# EAGLE design LP11F7826 (EAGLE 6.2)
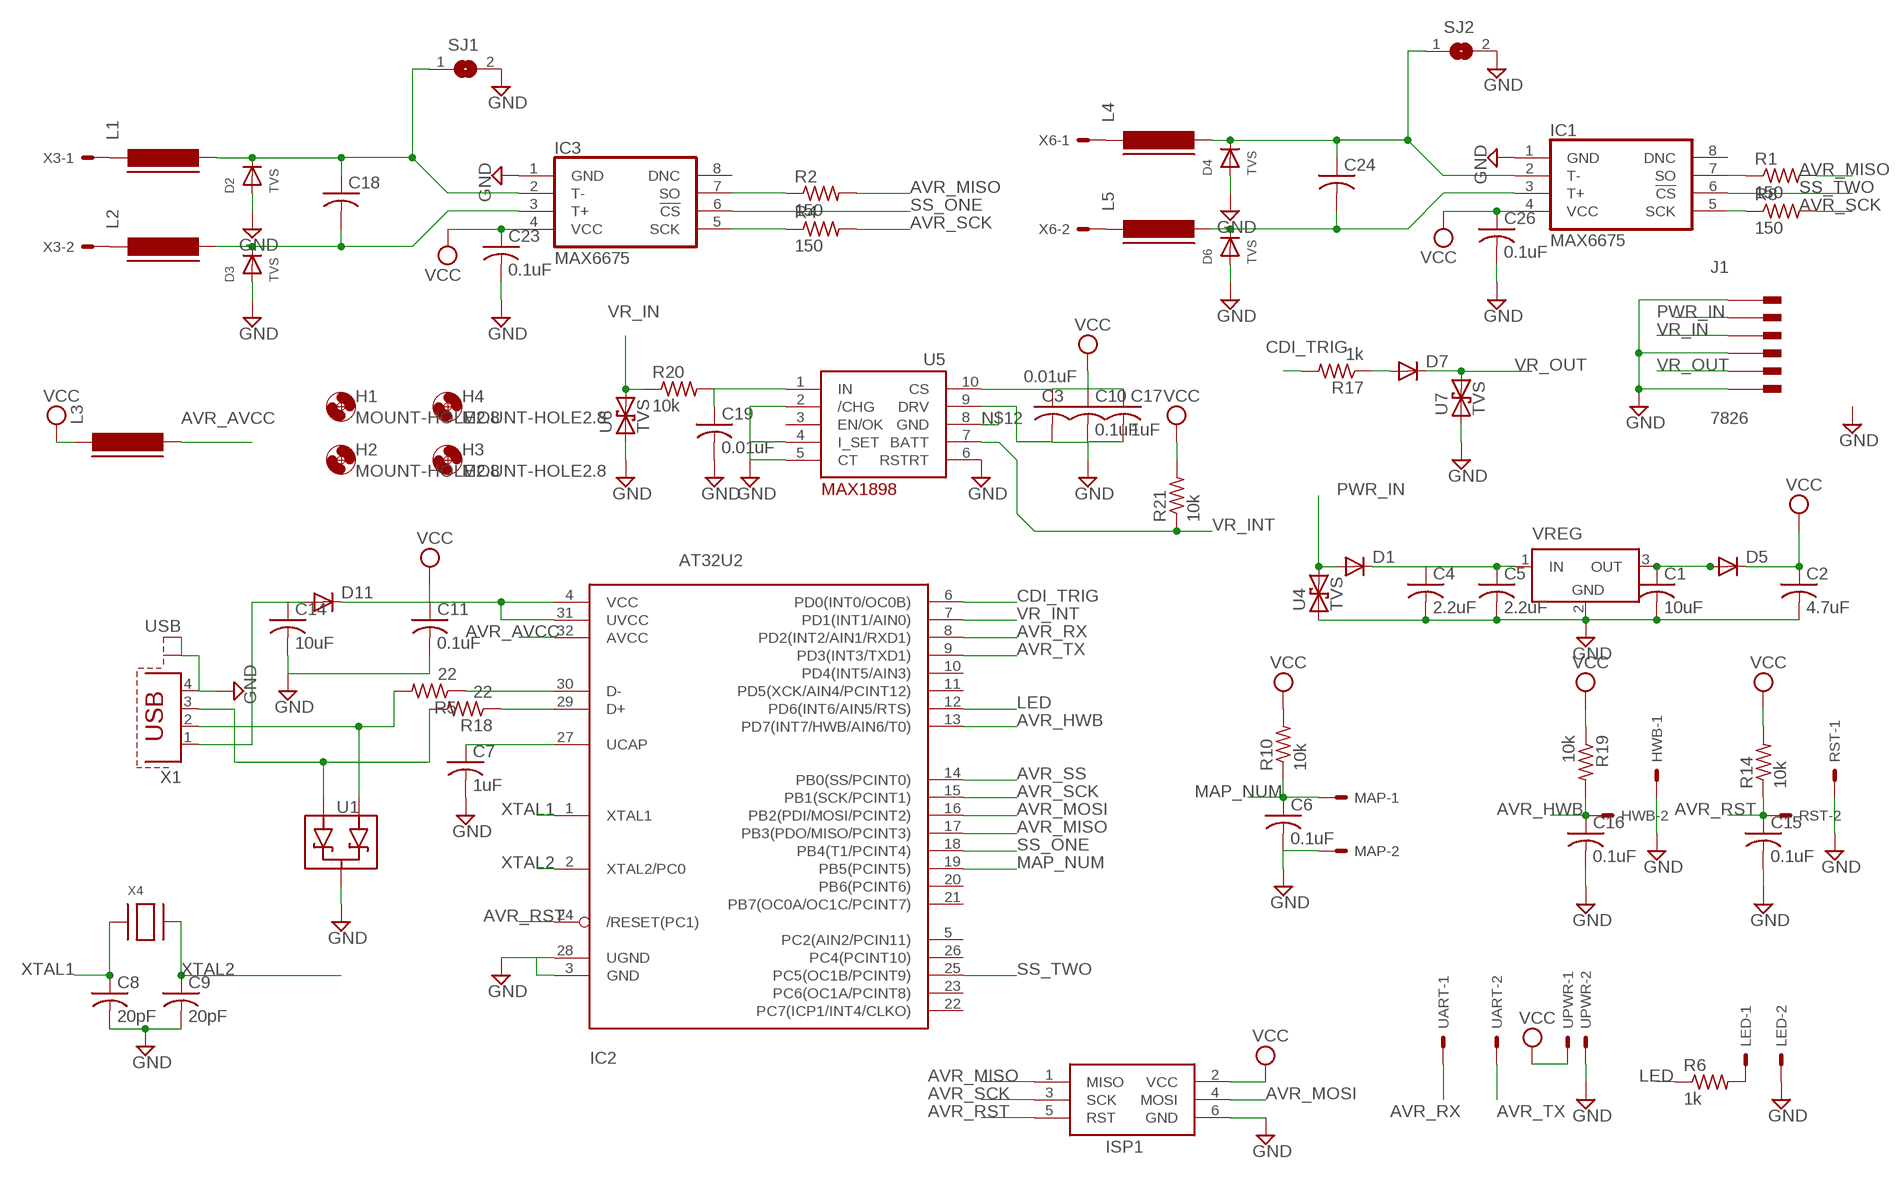
[diagram p0: schematic, sheet 1]

## Parts
C1  10uF  C-USC1206  [C1206]
C2  4.7uF  C-USC1210  [C1210]
C3  0.01uF  C-USC0805  [C0805]
C4  2.2uF  C-USC1206  [C1206]
C5  2.2uF  C-USC1210  [C1210]
C6  0.1uF  C-USC0805  [C0805]
C7  1uF  C-USC0805  [C0805]
C8  20pF  C-USC0805  [C0805]
C9  20pF  C-USC0805  [C0805]
C10  0.1uF  C-USC0805  [C0805]
C11  0.1uF  C-USC0805  [C0805]
C14  10uF  C-USC0805  [C0805]
C15  0.1uF  C-USC0805  [C0805]
C16  0.1uF  C-USC0805  [C0805]
C17  1uF  C-USC0805  [C0805]
C18  C-USC0805  [C0805]
C19  0.01uF  C-USC0805  [C0805]
C23  0.1uF  C-USC0805  [C0805]
C24  C-USC0805  [C0805]
C26  0.1uF  C-USC0805  [C0805]
D1  CGRM4001-G  [SOD-123_MINI-SMA]
D2  TVS  DIODESOD-323F  [SOD-323F]
D3  TVS  DIODESOD-323F  [SOD-323F]
D4  TVS  DIODESOD-323F  [SOD-323F]
D5  CGRM4001-G  [SOD-123_MINI-SMA]
D6  TVS  DIODESOD-323F  [SOD-323F]
D7  CGRM4001-G  [SOD-123_MINI-SMA]
D11  CGRM4001-G  [SOD-123_MINI-SMA]
H1  MOUNT-HOLE2.8  [2,8]
H2  MOUNT-HOLE2.8  [2,8]
H3  MOUNT-HOLE2.8  [2,8]
H4  MOUNT-HOLE2.8  [2,8]
HWB  87758-0216  [87758-0216]
IC1  MAX6675  IC_MAX31855-SO-8  [SO-8]
IC2  AT32U2  ATMEGA32U2-TQFP  [TQFP32-08]
IC3  MAX6675  IC_MAX31855-SO-8  [SO-8]
ISP1  AVRISP-6  [AVRISP]
J1  7826  PIN262409-1  [7806HEADER]
L1  FERRITE-0805  [FB805]
L2  FERRITE-0805  [FB805]
L3  FERRITE-0805  [FB805]
L4  FERRITE-0805  [FB805]
L5  FERRITE-0805  [FB805]
LED  87758-0216  [87758-0216]
MAP  87758-0216  [87758-0216]
R1  150  R-US_R0805  [R0805]
R2  150  R-US_R0805  [R0805]
R4  150  R-US_R0805  [R0805]
R5  22  R-US_R0805  [R0805]
R6  1k  R-US_R0805  [R0805]
R8  150  R-US_R0805  [R0805]
R10  10k  R-US_R0805  [R0805]
R14  10k  R-US_R0805  [R0805]
R17  1k  R-US_R0805  [R0805]
R18  22  R-US_R0805  [R0805]
R19  10k  R-US_R0805  [R0805]
R20  10k  R-US_R0805  [R0805]
R21  10k  R-US_R0805  [R0805]
RST  87758-0216  [87758-0216]
SJ1  SJ  [SJ]
SJ2  SJ  [SJ]
U1  MMBZ27VCLT1  [SOT23-3]
U4  TVS  [SMA-DIODE]
U5  MAX9924  MAX1898U  [UMAX10]
U6  TVS  [SMA-DIODE]
U7  TVS  [SMA-DIODE]
UART  87758-0216  [87758-0216]
UPWR  87758-0216  [87758-0216]
VREG  LT1963EST-3.3  [SOT223]
X1  USB  PN61729-S  [PN61729-S]
X3  22-23-2021  [22-23-2021]
X4  XTALNX5032  [NX5032]
X6  22-23-2021  [22-23-2021]

## Nets
AVR_AVCC: IC2.32(AVCC) L3.2
AVR_HWB: C16.1 HWB.2 IC2.13(PD7(INT7/HWB/AIN6/T0)) R19.2
AVR_MISO: IC2.17(PB3(PDO/MISO/PCINT3)) ISP1.1(MISO) R1.2 R2.2
AVR_MOSI: IC2.16(PB2(PDI/MOSI/PCINT2)) ISP1.4(MOSI)
AVR_RST: C15.1 IC2.24(/RESET(PC1)) ISP1.5(RST) R14.1 RST.2
AVR_RX: IC2.8(PD2(INT2/AIN1/RXD1)) UART.1
AVR_SCK: IC2.15(PB1(SCK/PCINT1)) ISP1.3(SCK) R4.2 R8.2
AVR_SS: IC2.14(PB0(SS/PCINT0))
AVR_TX: IC2.9(PD3(INT3/TXD1)) UART.2
CDI_TRIG: IC2.6(PD0(INT0/OC0B)) R17.2
GND: C1.2 C2.2 C3.2 C4.2 C5.2 C6.2 C7.2 C8.2 C9.2 C10.2 C11.2 C14.2 C15.2 C16.2 C17.2 C19.2 C23.2 C26.2 D2.A D3.A D4.A D6.A HWB.1 IC1.1(GND) IC2.3(GND) IC2.28(UGND) IC3.1(GND) ISP1.6(GND) J1.A1 J1.A2 J1.A5 J1.A6 J1.A11 J1.A12 LED.2 MAP.2 RST.1 SJ1.2 SJ2.2 U1.3(C) U4.A U5.2(/CHG) U5.4(I_SET) U5.5(CT) U5.6(RSTRT) U5.9(DRV) U6.A U7.A UPWR.2 VREG.2(GND) X1.4 X1.S1 X1.S2
LED: IC2.12(PD6(INT6/AIN5/RTS)) R6.1
MAP_NUM: C6.1 IC2.19(PB5(PCINT5)) MAP.1 R10.1
N$1: C14.1 D11.A X1.1
N$5: C4.1 C5.1 D1.C VREG.1(IN)
N$6: C18.1 D2.C IC3.2(T-) L1.2 SJ1.1
N$7: C18.2 D3.C IC3.3(T+) L2.2
N$8: C1.1 D5.A VREG.3(OUT)
N$9: LED.1 R6.2
N$10: C24.1 D4.C IC1.2(T-) L4.2 SJ2.1
N$11: C24.2 D6.C IC1.3(T+) L5.2
N$12: U5.8(GND)
N$13: IC1.5(SCK) R8.1
N$15: IC2.30(D-) R5.1
N$16: L1.1 X3.1
N$17: L2.1 X3.2
N$18: IC3.5(SCK) R4.1
N$19: IC2.29(D+) R18.1
N$20: C7.1 IC2.27(UCAP)
N$22: IC3.7(SO) R2.1
N$23: IC1.7(SO) R1.1
N$24: L4.1 X6.1
N$25: L5.1 X6.2
N$29: R5.2 U1.1(A1) X1.2
N$31: R18.2 U1.2(A2) X1.3
N$35: D7.A R17.1
N$46: C19.1 R20.2 U5.1(IN)
PWR_IN: D1.A J1.A9 J1.A10 U4.C
SS_ONE: IC2.18(PB4(T1/PCINT4)) IC3.6(!CS)
SS_TWO: IC1.6(!CS) IC2.25(PC5(OC1B/PCINT9))
VCC: C2.1 C3.1 C10.1 C11.1 C17.1 C23.1 C26.1 D5.C D11.C IC1.4(VCC) IC2.4(VCC) IC2.31(UVCC) IC3.4(VCC) ISP1.2(VCC) L3.1 R10.2 R14.2 R19.1 R21.2 U5.10(CS) UPWR.1
VR_IN: J1.A7 J1.A8 R20.1 U6.C
VR_INT: IC2.7(PD1(INT1/AIN0)) R21.1 U5.7(BATT)
VR_OUT: D7.C J1.A3 J1.A4 U7.C
XTAL1: C8.1 IC2.1(XTAL1) X4.P$1
XTAL2: C9.1 IC2.2(XTAL2/PC0) X4.P$2
Unconnected: IC1.8(DNC) IC2.5(PC2(AIN2/PCIN11)) IC2.10(PD4(INT5/AIN3)) IC2.11(PD5(XCK/AIN4/PCINT12)) IC2.20(PB6(PCINT6)) IC2.21(PB7(OC0A/OC1C/PCINT7)) IC2.22(PC7(ICP1/INT4/CLKO)) IC2.23(PC6(OC1A/PCINT8)) IC2.26(PC4(PCINT10)) IC3.8(DNC) U5.3(EN/OK)

## Power pins joined to a net without a drawn wire
GND: VREG.4(GND)

## Library data of the parts
C1-C11 C14-C19 C23 C24 C26 = adafruit:C-US: CAPACITOR, American symbol
D1 D5 D7 D11 = diode:CGRM400*-G: Molded plasitc,JEDEC SOD-123/Mini SMA Source: Comchip CGRM4001-G.pdf
D2-D4 D6 = adafruit:DIODE: Diode SMADIODE - SMA Surface Mount Package 20V 1A Schottky Diode Digikey: 641-1014-6-ND DO-1N4148 - Through Hole Small Current Diode SOD-123 20V 1 A (.5mV Vf) Schottky Diode - Digikey: MBRX120TPMSCT-ND SOD-323 10V 570mA (.38mV Vf, 3ns) Schottky Diode - Digikey: ZLLS410CT-ND SOD-523 30V 30mA Schottky Diode (RB751S-40TE61) - Digikey: RB751S-40TE61CT-ND SOT23-R/W - SOT23 Package (R = Solder Paste/Reflow Ovens, W = Hand-Soldering) BAT54Film 40V 300mA - Digikey: 497-7162-1-ND
H1-H4 = holes:MOUNT-HOLE: MOUNTING HOLE with drill center marker
HWB LED MAP RST UART UPWR = con-molex:87758-0216: 2 Pin - 2mm Dual Row Single Wafer, Vertical T/H HDR Source: http://www.molex.com/pdm_docs/sd/877580616_sd.pdf; MPN: 87758-0216; OC_FARNELL: unknown; OC_NEWARK: 94M1513
IC1 IC3 = dp_devices:IC_MAX31855
IC2 = adafruit:ATMEGA32U2: ATmega32u2 Pin compatible with the atmega8u2, atmega16u2 and atmega32u2 8, 16 or 32 K flash, 1K RAM, 512b EEPROM 8 bit and 16 bit timer (5 PWM total) UART, SPI (no I2C!) USB with 4 endpoints, LUFA compatible 22 I/O lines, analog comparator (no ADC!) Comes with DFU bootloader burned in!
ISP1 = adafruit:AVRISP: AVR ISP HEADER Standard 6 pin header for AVR programming
J1 = 7806_quick:PIN2: Flachstecker Typ Tyco/Electronics/AMP TAB, FASTON Printed Circuit Board Tabs Source: http://www.buerklin.com, http://catalog.tycoelectronics.com; OC_FARNELL: unknown; OC_NEWARK: unknown
L1-L5 = dp_devices:FERRITE: Ferrite bead in various packages
R1 R2 R4-R6 R8 R10 R14 R17-R21 = resistor:R-US_: RESISTOR, American symbol
SJ1 SJ2 = jumper:SJ: SMD solder JUMPER
U1 = SparkFun-DiscreteSemi:MMBZ27VCLT1: 40W Zener-diode transient voltage suppressor (ESD protection)
U4 U6 U7 = SparkFun-DiscreteSemi:TVS: Transient voltage suppressor- prevents ESD on inputs. Ignore package description- MBRA140 is NOT this type of part!!!
U5 = adafruit:MAX1898: Maxim MAX1898 li-poly battery charger http://www.ladyada.net/library/eagle
VREG = linear-technology:LT1963EST: 1.5A, Low Noise, Fast Transient Response LDO Regulator Source: http://www.linear.com/pc/downloadDocument.do?navId=H0,C3,P2222,D3148; MPN: LT1963EST-3.3; OC_FARNELL: 1501032; OC_NEWARK: 57M7546
X1 = con-berg:PN61729-S: BERG USB connector; OC_FARNELL: unknown; OC_NEWARK: unknown
X3 X6 = con-molex:22-23-2021: .100" (2.54mm) Center Header - 2 Pin; MF: MOLEX; MPN: 22-23-2021; OC_FARNELL: 1462926; OC_NEWARK: 25C3832
X4 = adafruit:XTAL: Low cost SMT crystals, no capacitors included http://www.ladyada.net/library/eagle

## Board
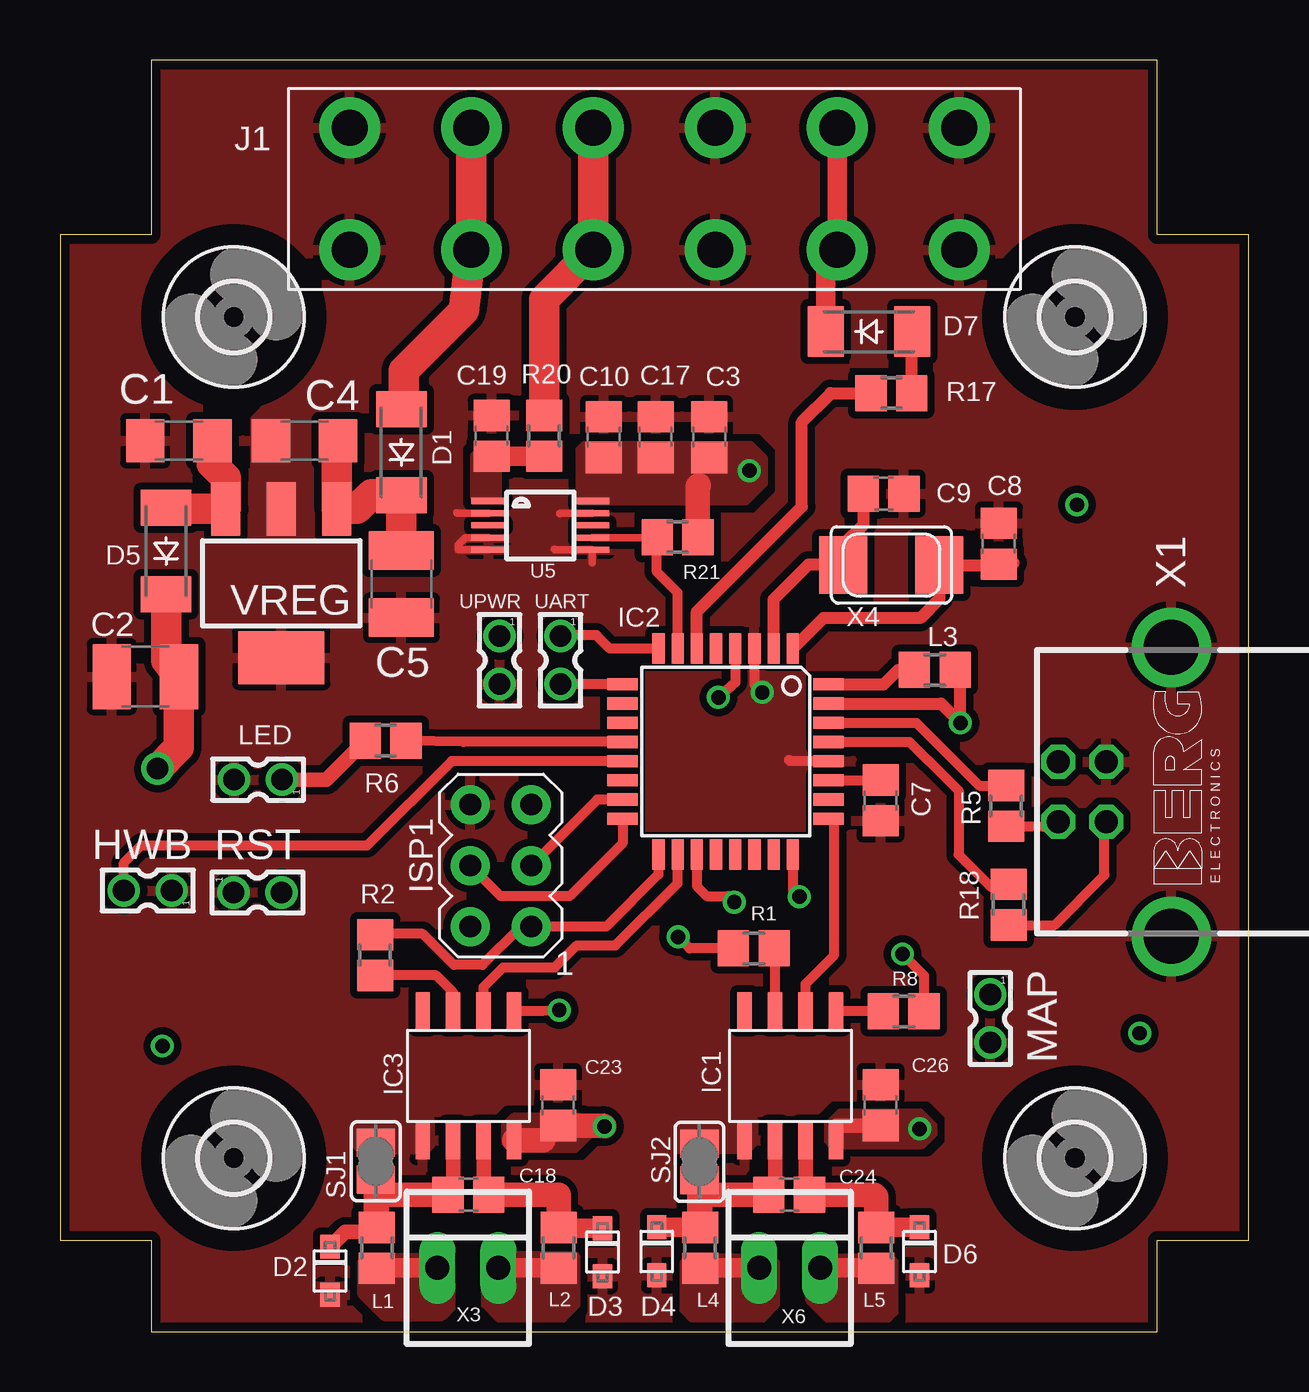
[diagram p1: board, top side]
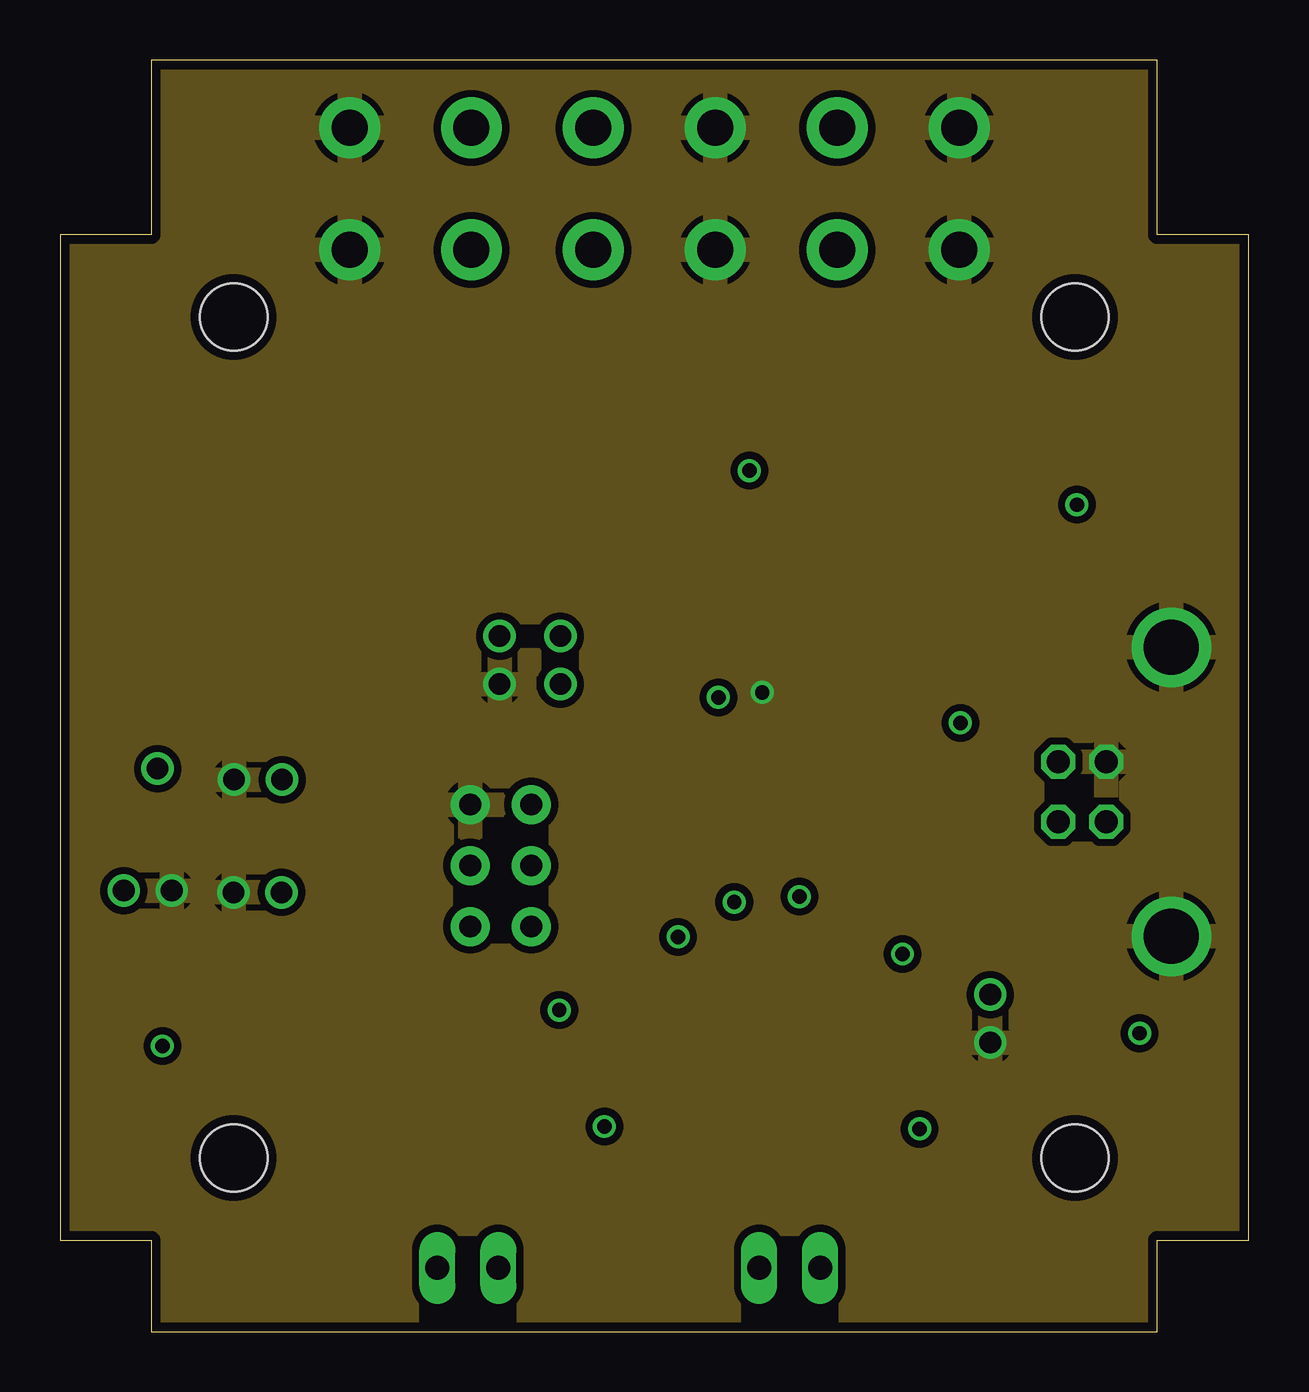
[diagram p2: board, inner layer Route2]
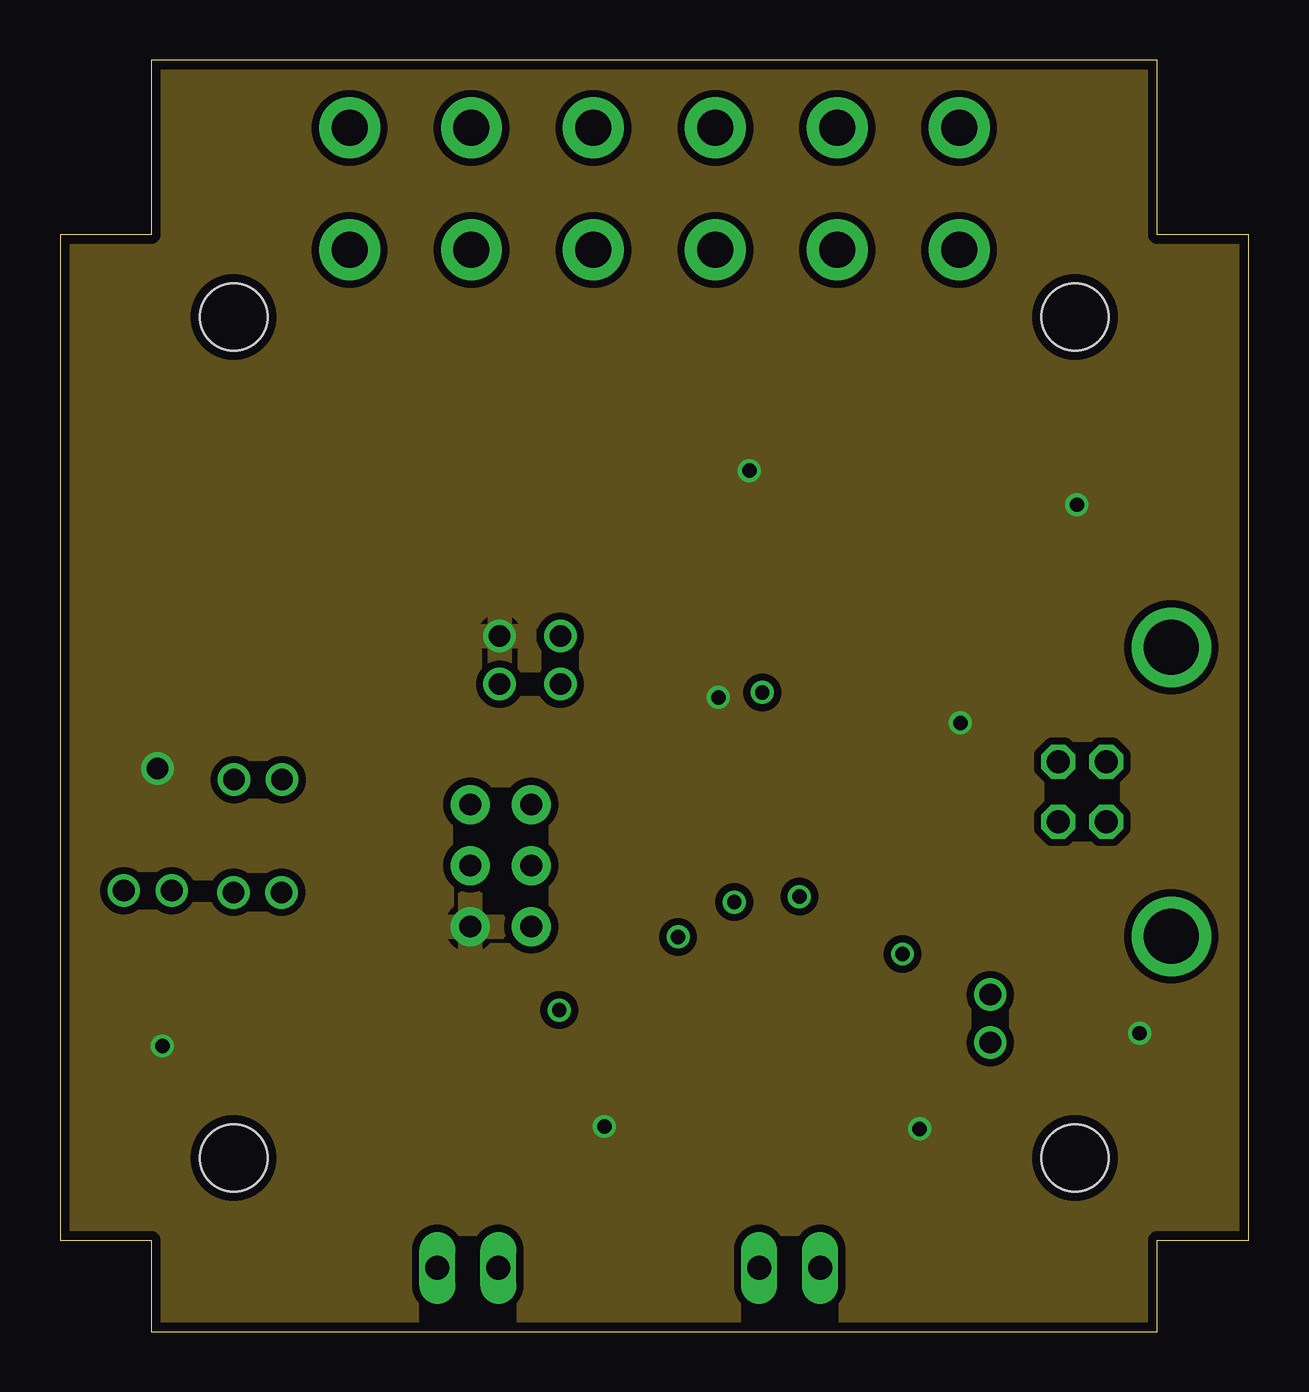
[diagram p3: board, inner layer Route15]
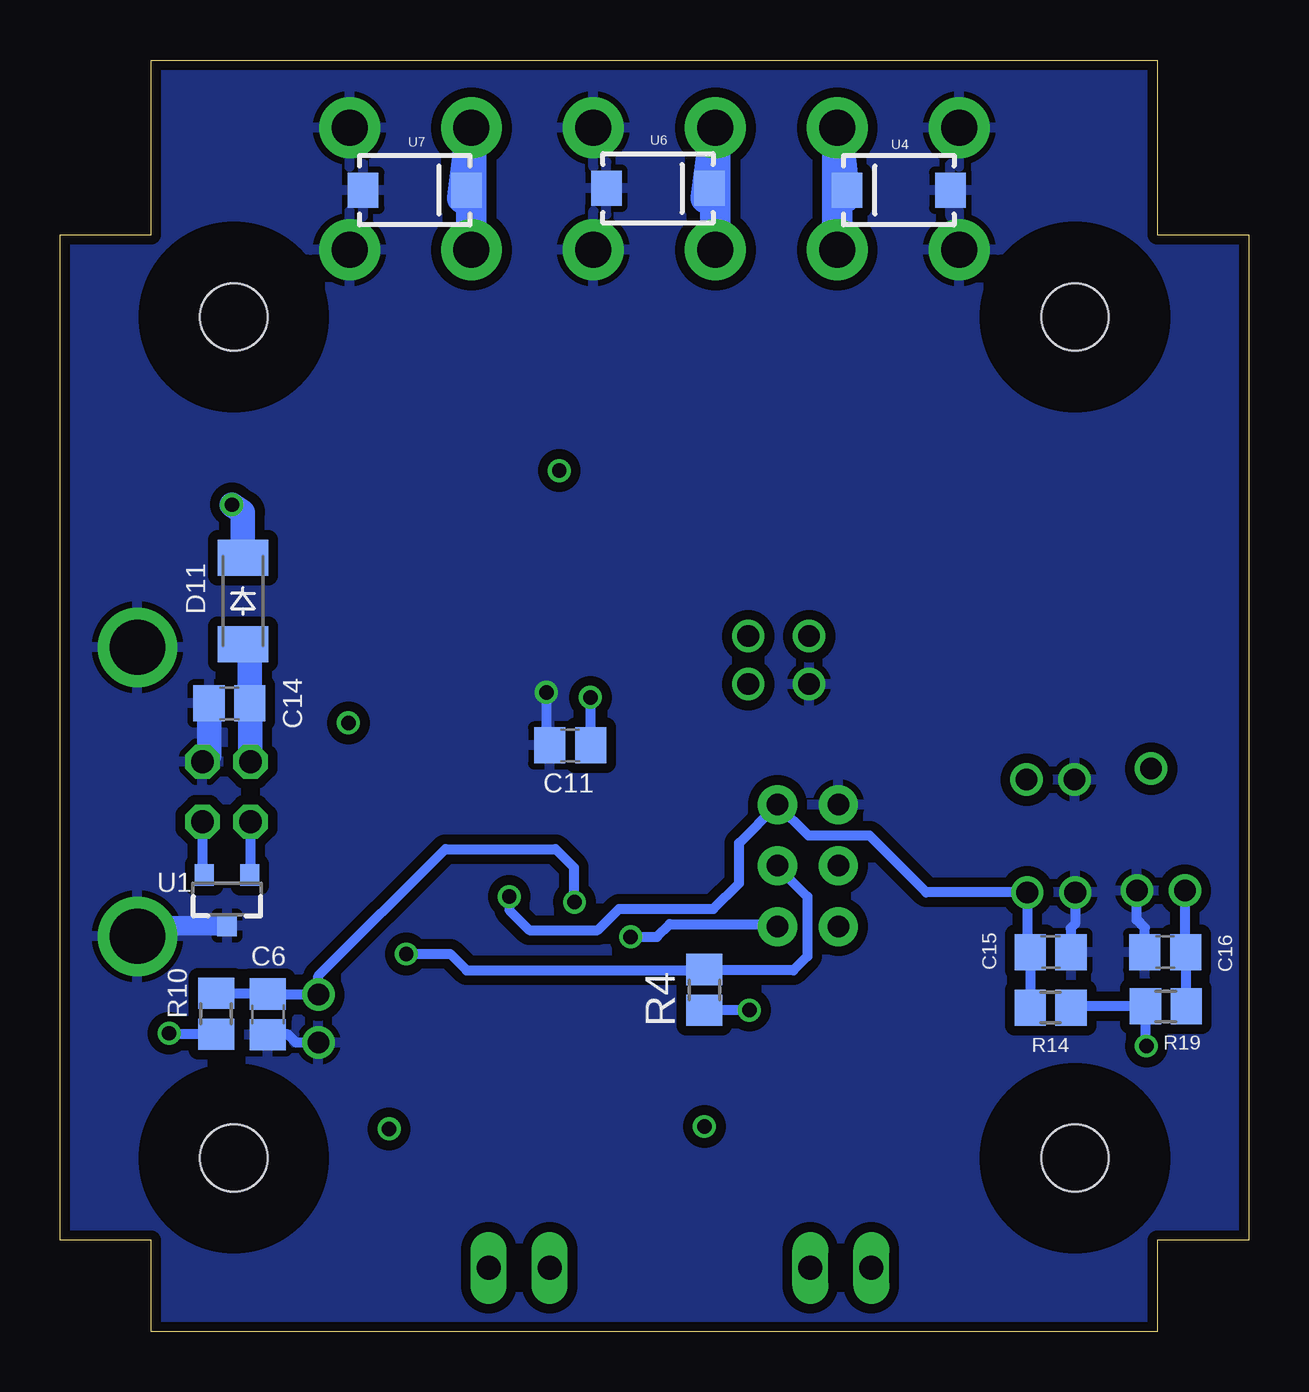
[diagram p4: board, bottom side, seen from below]

Size 49.53 x 53 mm. Coordinates in mm from the lower left corner, seen from the top.
Outline: 0,3.81 3.81,3.81 3.81,0 45.72,0 45.72,3.81 49.53,3.81 49.53,45.72 45.72,45.72 45.72,53 3.81,53 3.81,45.72 0,45.72 0,3.81
Copper layers (1*16): Top 0.0356mm / dielectric 1.5011mm / Bottom 0.0356mm
Design rules: minimum track width 6mil, minimum drill 13mil, track to track 6mil, track to pad 6mil, pad to pad 6mil, via to via 6mil, smd to smd 6mil, copper to edge 15mil, drill to drill 6mil, minimum pad ring 7mil, minimum via ring 7mil, stop-mask expansion 4mil, vias tented up to drill 0mil, thermal gap 10mil

### Footprints (pad centres in the part's own frame; a part is rotated, then mirrored left to right if it is on the bottom)
C1206 = smd 1.6 x 1.8: 1 -1.4,0; 2 1.4,0
C1210 = smd 1.6 x 2.7: 1 -1.4,0; 2 1.4,0
C0805 = smd 1.3 x 1.5: 1 -0.85,0; 2 0.85,0
SOD-123_MINI-SMA = smd 1.5 x 2.1: A 1.8,0; C -1.8,0
SOD-323F = smd 1 x 0.8: A -1,0; C 1,0
2,8 = hole 2.8: 0,0
87758-0216 = drill 0.9 pad 1.27: 1 0,-1; 2 0,1
SO-8 = smd 0.6 x 1.55: 1 -1.905,-2.69; 2 -0.635,-2.69; 3 0.635,-2.69; 4 1.905,-2.69; 5 1.905,2.71; 6 0.635,2.71; 7 -0.635,2.71; 8 -1.905,2.71
TQFP32-08 = smd 1.27 x 0.508: 1 -4.293,2.8; 2 -4.293,2; 3 -4.293,1.2; 4 -4.293,0.4; 5 -4.293,-0.4; 6 -4.293,-1.2; 7 -4.293,-2; 8 -4.293,-2.8; 17 4.293,-2.8; 18 4.293,-2; 19 4.293,-1.2; 20 4.293,-0.4; 21 4.293,0.4; 22 4.293,1.2; 23 4.293,2; 24 4.293,2.8 | smd 0.508 x 1.27: 9 -2.8,-4.293; 10 -2,-4.293; 11 -1.2,-4.293; 12 -0.4,-4.293; 13 0.4,-4.293; 14 1.2,-4.293; 15 2,-4.293; 16 2.8,-4.293; 25 2.8,4.293; 26 2,4.293; 27 1.2,4.293; 28 0.4,4.293; 29 -0.4,4.293; 30 -1.2,4.293; 31 -2,4.293; 32 -2.8,4.293
AVRISP = drill 0.9 pad 1.626: 1 -1.27,2.54; 2 1.27,2.54; 3 -1.27,0; 4 1.27,0; 5 -1.27,-2.54; 6 1.27,-2.54
7806HEADER = drill 1.5 pad 2.54: A1 -2.54,-12.7; A2 2.54,-12.7; A3 -2.54,-7.62; A4 2.54,-7.62; A5 -2.54,-2.54; A6 2.54,-2.54; A7 -2.54,2.54; A8 2.54,2.54; A9 -2.54,7.62; A10 2.54,7.62; A11 -2.54,12.7; A12 2.54,12.7
FB805 = smd 1.3 x 1.5: 1 -0.85,0; 2 0.85,0
R0805 = smd 1.3 x 1.5: 1 -0.85,0; 2 0.85,0
SJ = smd 1.168 x 1.6: 1 -0.762,0; 2 0.762,0
SOT23-3 = smd 0.8 x 0.9: 1 -0.95,-1; 2 0.95,-1; 3 0,1.1
SMA-DIODE = smd 1.27 x 1.47: A -2.15,0; C 2.15,0
UMAX10 = smd 0.254 x 1.422: 1 -1.016,-2.159; 2 -0.508,-2.159; 3 0,-2.159; 4 0.508,-2.159; 5 1.016,-2.159; 6 1.016,2.159; 7 0.508,2.159; 8 0,2.159; 9 -0.508,2.159; 10 -1.016,2.159
SOT223 = smd 1.219 x 2.235: 1 -2.311,-3.099; 2 0,-3.099; 3 2.311,-3.099 | smd 3.6 x 2.2: 4 0,3.099
PN61729-S = drill 0.95 octagon: 1 1.25,4.71; 2 -1.25,4.71; 3 -1.25,2.71; 4 1.25,2.71 | drill 2.3 pad 2.9: S1 -6.02,0; S2 6.02,0
22-23-2021 = drill 1 long: 1 -1.27,0; 2 1.27,0
NX5032 = smd 2 x 2.4: P$1 2,0; P$2 -2,0

### Placement (x,y rotation side)
C1  4.95,37.13 180 top
C2  3.56,27.3 180 top
C3  27.05,37.29 90 top
C4  10.19,37.13 180 top
C5  14.22,31.17 270 top
C6  40.87,13.23 270 bottom
C7  34.19,22.15 270 top
C8  39.12,32.84 90 top
C9  34.32,34.92 0 top
C10  22.66,37.29 90 top
C11  28.27,24.43 180 bottom
C14  42.47,26.19 180 bottom
C15  8.26,15.82 0 bottom
C16  3.48,15.82 180 bottom
C17  24.82,37.29 90 top
C18  17.02,5.71 0 top
C19  17.98,37.34 90 top
C23  20.75,9.45 90 top
C24  30.38,5.71 0 top
C26  34.19,9.45 90 top
D1  14.22,36.65 90 top
D2  11.25,2.54 90 top
D3  22.61,3.33 90 top
D4  24.87,3.35 90 top
D5  4.42,32.54 90 top
D6  35.81,3.35 90 top
D7  33.71,41.68 0 top
D11  41.91,30.45 270 bottom
H1  7.24,42.29 0 top
H2  7.24,7.24 0 top
H3  42.29,42.29 0 top
H4  42.29,7.24 0 top
HWB  3.66,18.39 90 top
IC1  30.43,10.67 0 top
IC2  27.74,24.18 270 top
IC3  17.02,10.67 0 top
ISP1  18.36,19.43 180 top
J1  24.77,47.62 90 top
L1  13.21,3.51 90 top
L2  20.78,3.51 90 top
L3  36.45,27.58 180 top
L4  26.67,3.51 90 top
L5  34.01,3.51 90 top
LED  8.26,23.01 90 top
MAP  38.76,13.06 180 top
R1  28.91,15.98 180 top
R2  13.13,15.7 90 top
R4  22.68,14.25 90 bottom
R5  39.42,21.92 270 top
R6  13.56,24.64 180 top
R8  35.15,13.36 0 top
R10  43.03,13.26 270 bottom
R14  8.26,13.51 0 bottom
R17  34.65,39.12 180 top
R18  39.52,17.81 270 top
R19  3.45,13.56 0 bottom
R20  20.17,37.34 270 top
R21  25.73,33.12 0 top
RST  8.23,18.31 270 top
SJ1  13.16,7.11 90 top
SJ2  26.64,7.09 90 top
U1  42.57,18.03 180 bottom
U4  14.58,47.57 180 bottom
U5  20.02,33.6 270 top
U6  24.61,47.65 0 bottom
U7  34.75,47.57 0 bottom
UART  20.85,27.99 180 top
UPWR  18.31,27.99 180 top
VREG  9.22,31.19 180 top
X1  46.3,22.5 90 top
X3  16.99,2.67 0 top
X4  34.65,31.95 0 top
X6  30.4,2.67 0 top

### Tracks (layer width: path | path; a pad name or v marks a point on that pad's centre or on a via)
AVR_AVCC
  Top 0.508: IC2.32 34.32,26.98 34.92,27.58 L3.2
AVR_HWB
  Top 0.406: IC2.13 16.31,23.78 12.8,20.27 3.38,20.27 2.66,19.55 HWB.2
  Bottom 0.406: HWB.2 2.66,15.85 C16.1 2.63,13.59 R19.2
AVR_MISO  (via drill 0.6)
  Top 0.406: IC2.17 24.94,19.07 22.76,16.89 ISP1.1 19.2,16.89 17.6,15.29 16.41,15.29 15.11,16.59 13.17,16.59 R2.2 | R1.2 26.24,15.98 v25.76,16.46
  Bottom 0.406: v25.76,16.46 24.66,16.46 24.13,16.99 19.74,16.99 ISP1.1
AVR_MOSI
  Top 0.406: IC2.16 23.44,20.37 21.23,18.16 18.36,18.16 ISP1.4
AVR_RST  (via drill 0.6)
  Top 0.406: IC2.24 30.54,18.41 v30.81,18.14
  Bottom 0.406: v30.81,18.14 30.81,17.58 29.97,16.74 27.13,16.74 26.24,17.63 22.3,17.63 21.23,18.69 21.23,20.37 ISP1.5 18.34,20.68 15.8,20.68 13.44,18.31 RST.2 9.23,16.1 C15.1 R14.1
AVR_RX
  Top 0.406: IC2.8 22.91,28.47 22.35,29.03 20.89,29.03 UART.1
AVR_SCK  (via drill 0.6)
  Top 0.406: IC2.15 22.38,22.18 ISP1.3 | R8.2 36,14.85 v35.1,15.75
  Bottom 0.406: ISP1.3 19.63,19.38 18.39,18.14 18.39,15.65 18.97,15.06 22.64,15.06 R4.2 22.72,15.06 32.59,15.06 33.27,15.75 v35.1,15.75
AVR_TX
  Top 0.406: IC2.9 20.86,26.98 UART.2
CDI_TRIG
  Top 0.508: IC2.6 26.54,30.02 30.91,34.39 30.91,37.92 32.11,39.12 R17.2
GND  (via drill 0.6)
  Top 0.305: U5.2 16.56,34.11 16.54,34.14 | 22.17,32.05 U5.6 20.62,32.59 20.6,32.61 | U5.9 20.85,34.11 20.83,34.09 | U5.5 16.59,32.59 16.59,32.79 16.89,33.1 U5.4
  Top 0.406: IC2.3 28.94,26.97 v29.26,26.64 | IC2.28 30.42,23.78 30.38,23.82
  Bottom 0.406: v29.26,26.64 29.26,24.57 C11.2 | C16.2 4.33,16.83 4.67,17.17 4.67,18.37 HWB.1 | RST.1 7.23,17 7.42,16.82 7.42,15.99 C15.2 | MAP.2 39.69,12.06 40.03,12.39 40.86,12.39 C6.2
  Bottom 0.813: U1.3 45.85,16.93 X1.S1
  Bottom 1.016: C14.2 43.32,24.03 X1.4
  pour Route2 (isolate 0.305): 0.51,0.51 53,0.51 53,53 0.51,53
  pour Top (isolate 0.305, rank 2): 0,3.81 3.81,3.81 3.81,0 45.72,0 45.72,3.81 49.53,3.81 49.53,45.72 45.72,45.72 45.72,53 3.81,53 3.81,45.72 0,45.72
  pour Top (isolate 0.305, no thermals): 12.29,8.97 12.29,7.77 12.52,7.54 15.24,7.54 15.47,7.77 15.47,8.81 15.27,9.02 12.32,9.02
  pour Top (isolate 0.305, no thermals): 28.96,7.95 28.96,8.81 28.73,9.04 25.68,9.04 25.37,8.74 25.37,7.9 25.7,7.57 28.63,7.57 28.96,7.9
  pour Top (no thermals): 11.73,0.94 11.4,0.61 10.57,0.61 10.16,1.02 10.16,1.5 10.57,1.91 11.71,1.91 11.73,1.93
  pour Top (no thermals): 8.13,33.3 8.13,38.02 8.51,38.4 9.86,38.4 10.13,38.13 10.13,32.59 9.75,32.21 9.09,32.21 8.13,33.17
  pour Bottom (isolate 0.406): 0,3.81 3.81,3.81 3.81,0 45.72,0 45.72,3.81 49.53,3.81 49.53,45.72 45.72,45.72 45.72,53 3.81,53 3.81,45.72 0,45.72
LED
  Top 0.406: IC2.12 16.82,24.58 R6.1
MAP_NUM  (via drill 0.6)
  Top 0.406: IC2.19 26.54,18.57 26.95,18.16 27.84,18.16 v28.09,17.91
  Bottom 0.406: v28.09,17.91 28.12,17.93 28.12,19.36 28.88,20.12 33.48,20.12 38.76,14.83 MAP.1 40.84,14.06 C6.1 43,14.08 R10.1
N$1
  Bottom 1.016: X1.1 41.59,26.16 C14.1 41.62,28.24 D11.A
N$5
  Top 1.27: C5.1 D1.C 14.18,34.9 12.98,34.9 12.37,34.29 VREG.1 11.53,37.08 C4.1
N$6
  Top 0.61: IC3.2 16.38,5.93 C18.1 | 13.03,4.17 11.89,4.17 D2.C
  Top 0.813: 13.41,5.71 13.21,5.92 | 13.03,4.17 L1.2
  Top 1.016: 13.21,5.92 L1.2 13.16,4.41 SJ1.1 | C18.1 13.41,5.71
N$7
  Top 0.61: IC3.3 17.65,5.93 C18.2
  Top 0.813: D3.C 20.8,4.33 L2.2
  Top 1.016: L2.2 20.78,5.71 C18.2
N$8
  Top 1.27: C1.1 6.33,36.98 6.33,36.17 6.91,35.59 VREG.3 4.47,34.29 D5.A
N$9
  Top 0.61: LED.1 11.09,23.01 R6.2
N$10
  Top 0.61: IC1.2 29.79,5.98 C24.1
  Top 0.813: 26.75,5.71 26.67,5.64 | D4.C L4.2
  Top 1.016: 26.67,5.64 L4.2 26.64,4.38 SJ2.1 | C24.1 26.75,5.71
N$11
  Top 0.61: IC1.3 31.06,5.88 C24.2
  Top 0.813: 33.93,5.71 34.01,5.64 | D6.C L5.2
  Top 1.016: L5.2 34.01,5.64 | C24.2 33.93,5.71
N$13
  Top 0.406: IC1.5 34.29,13.38 R8.1
N$15
  Top 0.406: IC2.30 35.68,25.38 38.3,22.76 39.41,22.76 R5.1
N$16
  Top 0.813: X3.1 L1.1
  pour Top (no thermals): 15.85,3.07 12.75,3.07 12.57,2.9 12.57,1.6 13.51,0.66 15.9,0.66 16.28,1.04 16.28,2.69 15.9,3.07
N$17
  Top 0.813: X3.2 20.77,2.67 L2.1
  pour Top (no thermals): 21.46,3.15 18.01,3.15 17.73,2.87 17.73,1.17 18.29,0.61 20.95,0.61 21.49,1.14 21.49,3.12
N$18  (via drill 0.6)
  Top 0.406: IC3.5 20.11,13.38 v20.8,13.41
  Bottom 0.406: v20.8,13.41 R4.1
N$19
  Top 0.406: IC2.29 35.39,24.58 36.17,23.8 36.2,23.8 37.44,22.55 37.44,19.89 38.79,18.54 39.41,18.54 R18.1
N$20
  Top 0.406: IC2.27 34.17,22.98 C7.1
N$22
  Top 0.406: IC3.7 16.38,14.15 15.67,14.86 13.14,14.86 R2.1
N$23
  Top 0.406: IC1.7 29.79,15.94 R1.1
N$24
  Top 0.813: X6.1 26.68,2.67 L4.1
  pour Top (no thermals): 29.57,3.05 26.21,3.05 26.01,2.84 26.01,0.97 26.42,0.56 29.21,0.56 29.79,1.14 29.79,2.87 29.59,3.07
N$25
  Top 0.813: X6.2 L5.1
  pour Top (no thermals): 31.78,3.07 34.57,3.07 34.72,2.92 34.72,0.84 34.44,0.56 32.03,0.56 31.27,1.32 31.27,2.67 31.67,3.07
N$29
  Top 0.406: R5.2 41.41,21.07 X1.2
  Bottom 0.406: X1.2 41.59,19.06 U1.1
N$31
  Top 0.406: R18.2 41.44,16.95 U1.2 43.52,21.18 X1.3
  Bottom 0.406: X1.3 43.59,19.11 U1.2
N$35
  Top 0.508: R17.1 35.5,41.67 D7.A
N$46
  Top 0.813: R20.2 C19.1
  pour Top (no thermals): 17.42,34.65 18.08,34.65 18.26,34.82 18.26,36.5 17.98,36.78 17.53,36.78 17.25,36.5 17.25,34.8 17.37,34.67
PWR_IN
  Top 1.27: J1.A10 J1.A9 16.82,42.55 14.33,40.06 14.33,38.55 D1.A
  Bottom 1.27: J1.A9 J1.A10 16.81,47.29 U4.C
SS_ONE
  Top 0.406: IC3.6 17.65,14.38 18.47,15.19 20.62,15.19 21.54,16.1 23.14,16.1 25.73,18.69 IC2.18
SS_TWO
  Top 0.406: IC1.6 31.06,14.5 32.26,15.7 32.26,21.15 IC2.25
VCC  (via drill 0.6, 0.9)
  Top 0.406: IC2.4 28.14,27.07 v27.43,26.44
  Top 0.508: IC2.31 36.71,26.18 v37.52,25.38 37.52,27.37 L3.1
  Top 0.61: 20.13,7.98 C23.1 | C26.1 32.33,8.6 32.33,7.52
  Top 1.016: IC3.4 20.13,7.98 | C23.1 22.64,8.6 v22.68,8.56 | R21.2 26.58,35.24 26.62,35.28
  Top 1.27: D5.C 4.42,27.99 C2.1 4.96,24.36 v4.06,23.47
  Bottom 0.406: v27.43,26.44 27.43,24.45 C11.1 | R14.2 7.35,13.56 R19.1 4.3,11.95 v4.27,11.91 | R10.2 44.95,12.41 v44.98,12.45
  Bottom 1.016: D11.C 41.91,34.16 v42.37,34.47
  other vias: 35.81,8.46 28.73,35.89
  pour Route15 (isolate 0.305): 0.51,0.51 53,0.51 53,53 0.51,53
  pour Top (isolate 0.406, no thermals): 21.64,8.92 18.9,8.92 18.57,8.59 18.57,7.92 18.82,7.67 21.46,7.67 21.97,8.18 21.97,8.59
  pour Top (no thermals): 32.21,7.82 35.92,7.82 36.37,8.28 36.37,8.56 35.84,9.09 32.51,9.09 32.03,8.61 32.03,8
  pour Top (no thermals): 21.69,34.59 28.57,34.59 29.34,35.36 29.34,36.4 28.78,36.96 21.84,36.96 21.64,36.75 21.64,34.65
VR_IN
  Top 1.27: J1.A8 J1.A7 20.17,43.03 R20.1
  Bottom 1.27: J1.A7 J1.A8 22.61,47.23 U6.C
VR_INT
  Top 0.305: U5.7 24.86,33.1 R21.1
  Top 0.406: IC2.7 25.74,30.8 24.87,31.67 24.87,33.11 R21.1
VR_OUT
  Top 0.813: J1.A3 J1.A4 | J1.A3 | D7.C 31.91,44.61 J1.A3
  Bottom 1.27: J1.A3 J1.A4 32.77,47.23 U7.C
XTAL1
  Top 0.508: IC2.1 31.81,29.74 35.84,29.74 36.65,30.55 X4.P$1 39.65,31.95 39.73,32.03 39.15,32.03 C8.1
XTAL2
  Top 0.508: IC2.2 29.74,30.52 31.19,31.98 32.62,31.98 X4.P$2 32.64,32.79 33.47,33.62 C9.1